# EAGLE design domus-silicea - N2 - ESP8266-01 (EAGLE 7.3.0)
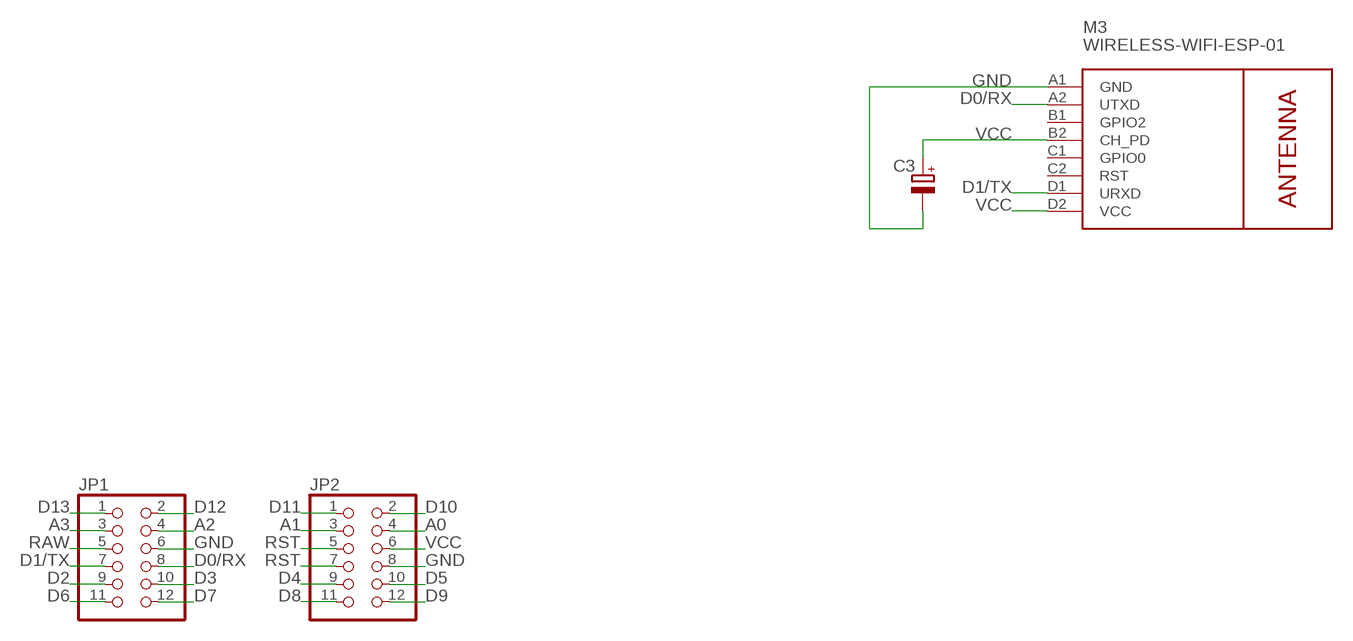
[diagram p0: schematic, sheet 1]

## Parts
C3  CPOL-EUE2,5-6E  [E2,5-6E]
JP1  PINHD-2X6  [2X06]
JP2  PINHD-2X6  [2X06]
M3  WIRELESS-WIFI-ESP-01  [WIRELESS-WIFI-ESP-01]

## Nets
A0: JP2.4
A1: JP2.3
A2: JP1.4
A3: JP1.3
D0/RX: JP1.8 M3.A2(UTXD)
D1/TX: JP1.7 M3.D1(URXD)
D2: JP1.9
D3: JP1.10
D4: JP2.9
D5: JP2.10
D6: JP1.11
D7: JP1.12
D8: JP2.11
D9: JP2.12
D10: JP2.2
D11: JP2.1
D12: JP1.2
D13: JP1.1
GND: C3.- JP1.6 JP2.8 M3.A1(GND)
RAW: JP1.5
RST: JP2.5 JP2.7
VCC: C3.+ JP2.6 M3.B2(CH_PD) M3.D2(VCC)
Unconnected: M3.B1(GPIO2) M3.C1(GPIO0) M3.C2(RST)

## Library data of the parts
C3 = rcl:CPOL-EU: POLARIZED CAPACITOR, European symbol
JP1 JP2 = pinhead:PINHD-2X6: PIN HEADER
M3 = diy-modules:WIRELESS-WIFI-ESP-01: Wireless Wi-Fi ESP-01 Module based on ESP8266 chip

## Board
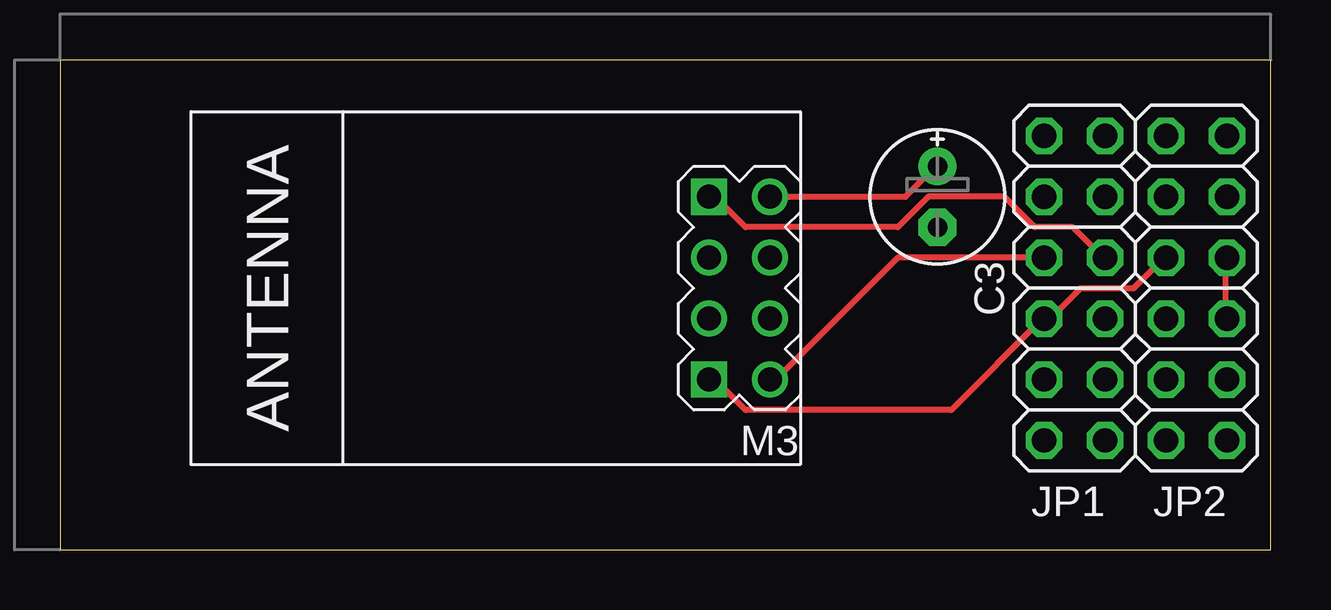
[diagram p1: board, top side]
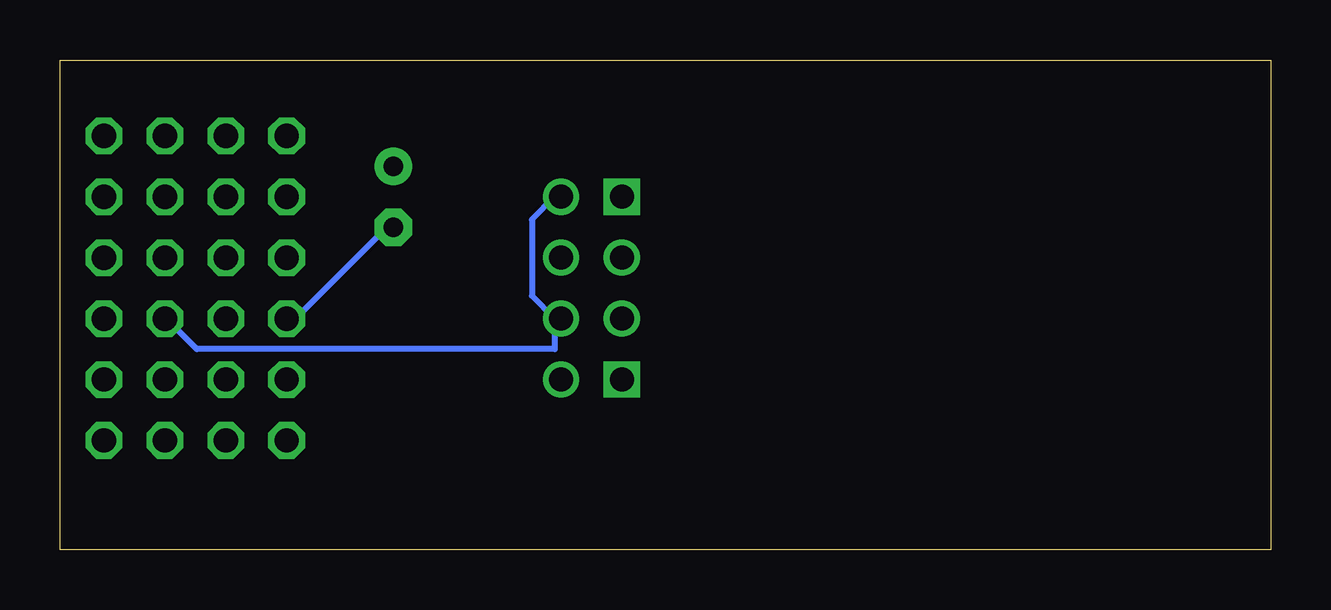
[diagram p2: board, bottom side, seen from below]

Size 50.47 x 20.44 mm. Coordinates in mm from the lower left corner, seen from the top.
Outline: 0,0 50.47,0 50.47,20.44 0,20.44 0,0
Copper layers (1*16): Top 0.035mm / dielectric 1.5mm / Bottom 0.035mm
Design rules "default": minimum track width 10mil, minimum drill 24mil, track to track 8mil, track to pad 8mil, pad to pad 8mil, via to via 8mil, smd to smd 8mil, copper to edge 40mil, drill to drill 8mil, minimum pad ring 10mil, minimum via ring 8mil, stop-mask expansion 4mil, vias tented up to drill 0mil, thermal gap 10mil

### Footprints (pad centres in the part's own frame; a part is rotated, then mirrored left to right if it is on the bottom)
E2,5-6E = drill 0.813 pad 1.575: + -1.27,0 | drill 0.813 pad 1.575 octagon: - 1.27,0
2X06 = drill 1.016 octagon: 1 -6.35,-1.27; 2 -6.35,1.27; 3 -3.81,-1.27; 4 -3.81,1.27; 5 -1.27,-1.27; 6 -1.27,1.27; 7 1.27,-1.27; 8 1.27,1.27; 9 3.81,-1.27; 10 3.81,1.27; 11 6.35,-1.27; 12 6.35,1.27
WIRELESS-WIFI-ESP-01 = drill 1 square: A1 -8.89,3.81; D1 -8.89,-3.81 | drill 1: A2 -11.43,3.81; B1 -8.89,1.27; B2 -11.43,1.27; C1 -8.89,-1.27; C2 -11.43,-1.27; D2 -11.43,-3.81

### Placement (x,y rotation side)
C3  36.58,14.73 270 top
JP1  42.29,10.92 90 top
JP2  47.37,10.92 90 top
M3  18.16,10.92 180 top

### Tracks (layer width: path | path; a pad name or v marks a point on that pad's centre or on a via)
D0/RX
  Top 0.254: JP1.8 34.92,12.19 29.85,7.11 M3.A2
D1/TX
  Top 0.254: M3.D1 27.31,14.73 28.57,13.46 34.92,13.46 36.2,14.73 39.37,14.73 40.64,13.46 42.23,13.46 43.5,12.19 JP1.7
GND
  Top 0.254: M3.A1 27.31,7.11 28.57,5.84 37.15,5.84 40.96,9.65 JP1.6 41.28,9.65 42.55,10.92 44.77,10.92 46.04,12.19 JP2.8
  Bottom 0.254: JP1.6 40.64,9.65 36.83,13.46 C3.-
RST
  Top 0.254: JP2.5 48.58,9.65 48.58,12.19 JP2.7
VCC
  Top 0.254: M3.D2 35.24,14.73 36.51,16 C3.+
  Bottom 0.254: 29.85,9.65 30.8,10.61 30.8,13.78 29.85,14.73 M3.D2 | 29.85,9.65 29.85,8.38 44.77,8.38 46.04,9.65 JP2.6 | 29.85,9.65 M3.B2